# Altium project Clase3_Refactor.PrjPcb
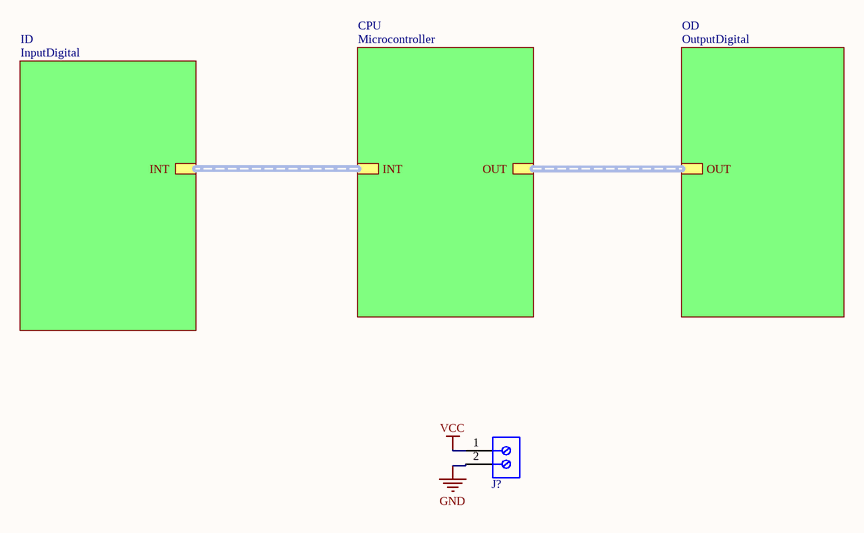
[diagram p0: main.SchDoc]
1 sheet, 1 parts. Net scope: hierarchical (ports join the sheet entries above them; power ports are global).

## Sheet main.SchDoc
size A4; SheetNumber: 1; SheetTotal: 4

### Parts
J?  691214110002  [691214110002]  (value not drawn)

### Sub-sheets
CPU = Microcontroller (file not in this document): INT, OUT
ID = InputDigital (file not in this document): INT
OD = OutputDigital (file not in this document): OUT

### Nets
GND: J?.2
VCC: J?.1

### Buses and harness runs
harness sheet CPU/INT = sheet ID/INT
harness sheet CPU/OUT = sheet OD/OUT

### Library data of the parts
J? = CMP-1502-02464-1: Serie 2141 - 3.50 mm Horizontal Entry Modular with Rising Cage Clamp WR-TBL, 2 pin; Manufacturer: Wurth Elektronik; Pin Number: 2; Pitch: 3.50mm; Datasheet URL: http://katalog.we-online.de/em/datasheet/6912141100xx.pdf; Packaging: Box; Mounting Technology: THT; Package Reference: 691214110002; Manufacturer URL: http://www.we-online.de; Part Number: 691214110002; Publisher: WurthElektronik; Operating Temperature: -40to105degC